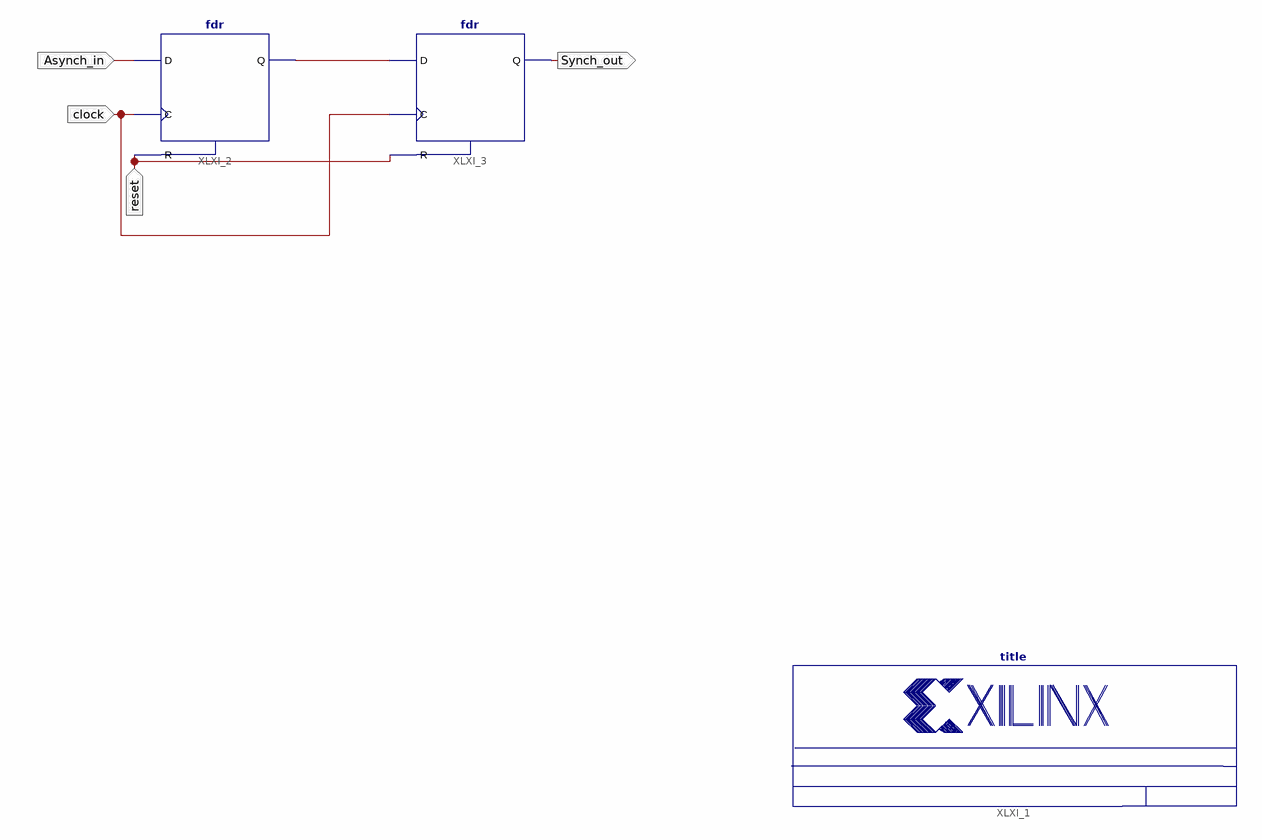
[diagram p0: schematic sheet 1]
// Xilinx ISE schematic fig_5_38.sch (spartan3e) as structural Verilog: 3 symbols, 4 ports
module fig_5_38 (
  input  Asynch_in,
  input  reset,
  input  clock,
  output Synch_out
);

  wire XLXN_1;

  title #(.TitleFieldText("Synchronizer when async input greater clock period"), .NameFieldText("Figure 5.38 A")) XLXI_1 ();
  fdr XLXI_2 (.C(clock), .D(Asynch_in), .R(reset), .Q(XLXN_1));
  fdr XLXI_3 (.C(clock), .D(XLXN_1), .R(reset), .Q(Synch_out));
endmodule
